# Altium schematic sheet 2X15A_PROTECTION_TOP.SchDoc
size Tabloid; Sheet_Name: Insert name in Document Parameters; Size: 11x17
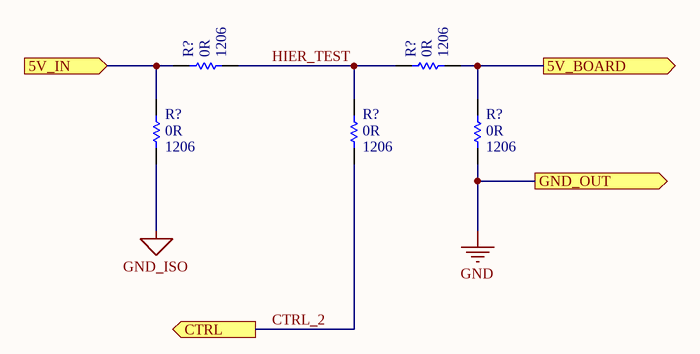
[diagram p0: 2X15A_PROTECTION_TOP.SchDoc]

## Parts
(Parts that share a designator on the sheet are numbered #1, #2 ... from top to bottom, then left to right.)
R?#1  value 0R  Package: 1206  [RES_1206]  (hidden comment: RC3216J000CS)
R?#2  value 0R  Package: 1206  [RES_1206]  (hidden comment: RC3216J000CS)
R?#3  value 0R  Package: 1206  [RES_1206]  (hidden comment: RC3216J000CS)
R?#4  value 0R  Package: 1206  [RES_1206]  (hidden comment: RC3216J000CS)
R?#5  value 0R  Package: 1206  [RES_1206]  (hidden comment: RC3216J000CS)

## Ports
5V_BOARD (out), 5V_IN (in), CTRL (out), GND_OUT (out)

## Nets
GND: R?#5.1 ; port GND_OUT
GND_ISO: R?#3.1
5V_BOARD: R?#2.1 R?#5.2 ; port 5V_BOARD
5V_IN: R?#1.2 R?#3.2 ; port 5V_IN
CTRL_2: R?#4.1 ; port CTRL
HIER_TEST: R?#1.1 R?#2.2 R?#4.2

## Notes on the sheet
- Sheet Name
- Project Title
- Global Project
- Size
- Group
- Revision
- Date
- Sheet
- of
- Filename
- Designers

## Library data of the parts
R?#1-R?#5 = RES_RC3216J000CS: RES - 0 OHM 1/4W - 1206; Manufacturer #1: Samsung Electro-Mechanics; Voltage Rating: 200V; GRAMS Lib Spec: 2.8; Magnetic Material: UNKNOWN; Polarized: NO; Tolerance: N/A; Current Rating: *; Power Max: 1/4W; HelpURL: http://www.samsungsem.com/kr/support/product-search/chip-resistor/RC3216J000CS.jsp; CreatedBy/Date: Arnaud Samson 12/07/18; VerifiedBy: Jonathan Bouchard 2018-07-13; Temperature: -55°C ~ 155°C; Manufacturer #2: *; Note: *; Assembly Type: SMD; Part Number #2: *; Part Number #1: RC3216J000CS; Supplier 1: Digi-Key; Supplier Part Number 1: 1276-3514-1-ND